# Altium project main_io.PrjPcb (part 5 of 6)

## Sheet battery_interface.SchDoc: LV Battery Interface
size A4; Organization: Badgerloop; Address1: 133 Engineering Research; Address2: Building; Address3: Madison, WI 53715; SheetNumber: 15
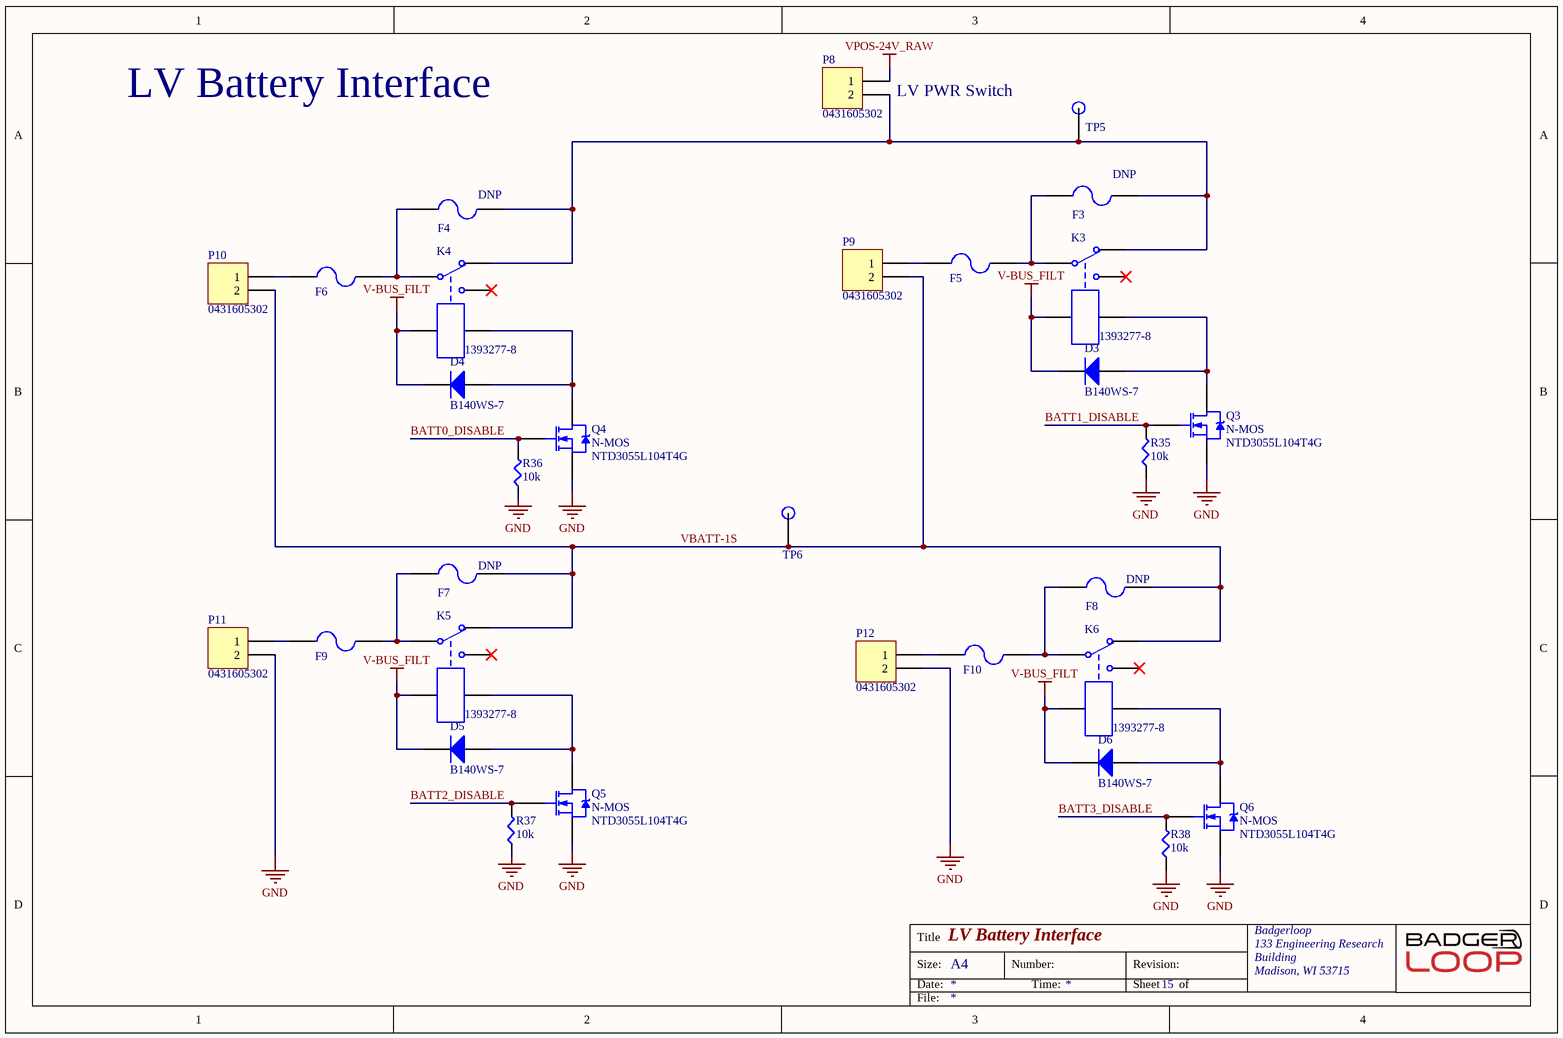
[diagram p14: battery_interface.SchDoc]

### Parts
D3  B140WS-7  [SODFL250X110-2N]
D4  B140WS-7  [SODFL250X110-2N]
D5  B140WS-7  [SODFL250X110-2N]
D6  B140WS-7  [SODFL250X110-2N]
F3  3568  [Fuse Holder 30A 500V 1 Circuit Blade Through Hole]  (value not drawn)
F4  3568  [Fuse Holder 30A 500V 1 Circuit Blade Through Hole]  (value not drawn)
F5  3568  [Fuse Holder 30A 500V 1 Circuit Blade Through Hole]  (value not drawn)
F6  3568  [Fuse Holder 30A 500V 1 Circuit Blade Through Hole]  (value not drawn)
F7  3568  [Fuse Holder 30A 500V 1 Circuit Blade Through Hole]  (value not drawn)
F8  3568  [Fuse Holder 30A 500V 1 Circuit Blade Through Hole]  (value not drawn)
F9  3568  [Fuse Holder 30A 500V 1 Circuit Blade Through Hole]  (value not drawn)
F10  3568  [Fuse Holder 30A 500V 1 Circuit Blade Through Hole]  (value not drawn)
K3  1393277-8  [RELAY AUTOMOTIVE SPDT 45A 24V - duplicate]
K4  1393277-8  [RELAY AUTOMOTIVE SPDT 45A 24V - duplicate]
K5  1393277-8  [RELAY AUTOMOTIVE SPDT 45A 24V - duplicate]
K6  1393277-8  [RELAY AUTOMOTIVE SPDT 45A 24V - duplicate]
P8  0431605302  [CONN HDR 2POS 7.50MM]
P9  0431605302  [CONN HDR 2POS 7.50MM]
P10  0431605302  [CONN HDR 2POS 7.50MM]
P11  0431605302  [CONN HDR 2POS 7.50MM]
P12  0431605302  [CONN HDR 2POS 7.50MM]
Q3  N-MOS  Manufacturer P/N: NTD3055L104T4G  [DPAK228P991X238-3N]
Q4  N-MOS  Manufacturer P/N: NTD3055L104T4G  [DPAK228P991X238-3N]
Q5  N-MOS  Manufacturer P/N: NTD3055L104T4G  [DPAK228P991X238-3N]
Q6  N-MOS  Manufacturer P/N: NTD3055L104T4G  [DPAK228P991X238-3N]
R35  10k  [SMD-0805-RES]
R36  10k  [SMD-0805-RES]
R37  10k  [SMD-0805-RES]
R38  10k  [SMD-0805-RES]
TP5  TP  [Test Point]  (value not drawn)
TP6  TP  [Test Point]  (value not drawn)

### Nets
GND: P11.2 P12.2 Q3.3(S) Q4.3(S) Q5.3(S) Q6.3(S) R35.1 R36.1 R37.1 R38.1
V-BUS_FILT: D3.2(K) D4.2(K) D5.2(K) D6.2(K) K3.1 K4.1 K5.1 K6.1  [project net MSTR_SW +]
VPOS-24V_RAW: P8.1
BATT0_DISABLE: Q4.1(G) R36.2
BATT1_DISABLE: Q3.1(G) R35.2
BATT2_DISABLE: Q5.1(G) R37.2
BATT3_DISABLE: Q6.1(G) R38.2
VBATT-1S: F7.2 F8.2 K5.3 K6.3 P9.2 P10.2 TP6.1
NetD3_1: D3.1(A) K3.2 Q3.4(D)
NetD4_1: D4.1(A) K4.2 Q4.4(D)
NetD5_1: D5.1(A) K5.2 Q5.4(D)
NetD6_1: D6.1(A) K6.2 Q6.4(D)
NetF3_1: F3.1 F5.2 K3.4
NetF3_2: F3.2 F4.2 K3.3 K4.3 P8.2 TP5.1
NetF4_1: F4.1 F6.2 K4.4
NetF5_1: F5.1 P9.1
NetF6_1: F6.1 P10.1
NetF7_1: F7.1 F9.2 K5.4
NetF8_1: F8.1 F10.2 K6.4
NetF9_1: F9.1 P11.1
NetF10_1: F10.1 P12.1

Not connected (* = marked no-connect by the designer): K3 5*; K4 5*; K5 5*; K6 5*

### Notes on the sheet
- LV Battery Interface
- (near P8) LV PWR Switch
- Title
- Size:
- Date:
- A4
- Number:
- Time:
- Revision:
- Sheet
- of
- File:

### Library data of the parts
D3-D6 = B140WS-7: as D28-D31 on sheet shutdown_circuit; Supplier 1: Digi-Key; Stock 1: 38792; Pricing 1: 1=0.41, 10=0.293, 100=0.1476, 500=0.13076, 1000=0.10176 (USD); Mount: Surface Mount; Number of Pins: 2; Weight: 0.000173oz; Contact Plating: Tin,Matte; Min Operating Temperature: -40°C; Max Operating Temperature: 125°C; Forward Current: 1A; Max Repetitive Reverse Voltage (Vrrm): 40V; Package Quantity: 3000; Packaging: Tape and Reel; Average Rectified Current: 1A; Max Forward Surge Current (Ifsm): 3A; Max Reverse Voltage (DC): 40V; Series: -; Length: 1.8mm; Width: 1.4mm; Height: 1.1mm; RoHS Compliant: Yes; ComponentLink1URL: http://www.mouser.com/ds/2/115/ds31543-56649.pdf?src-supplier=Mouser; ComponentLink1Description: http://www.mouser.com/ds/2/115/ds31543-56649.pdf?src-supplier=Mouser; ComponentLink2URL: http://www.diodes.com//datasheets/ds31543.pdf?src-supplier=Avnet+Europe; ComponentLink2Description: http://www.diodes.com//datasheets/ds31543.pdf?src-supplier=Avnet+Europe; ComponentLink3URL: http://www.diodes.com/datasheets/ds31543.pdf?src-supplier=Digi-Key; ComponentLink3Description: http://www.diodes.com/datasheets/ds31543.pdf?src-supplier=Digi-Key; Supplier Part Number 1: B140WS-7DICT-ND
F3-F10 = 3568: FUSE HOLDER MINI AUTO PC; Manufacturer: Keystone Electronics; Material: Brass,Tin,Nylon; Color: Black; Body Material: Nylon; Current Rating: 20A; Voltage Rating (AC): 500V; Number of Poles: 1; Illumination Type: Illuminated; Fuse Type: Automotive; Approvals: UL; Supplier 1: Digi-Key; Manufacturer Part Number: 3568; Stock 1: 0; Mount: PCB,Vertical; Contact Material: Brass,Tin; Contact Plating: Tin; Min Operating Temperature: -50°C; Max Operating Temperature: 145°C; Package Quantity: 1; Termination: PC Pin; Orientation: Vertical; Number of Circuits: 1; Voltage: 500V; Fuse Current: 20A; Length: 16mm; Depth: 6.73mm; Lead Free: Lead Free; REACH SVHC: No SVHC; Flammability Rating: UL94 V-0; ComponentLink1URL: http://www.keyelco.com/userAssets/file/M60-2p40.pdf?src-supplier=Future+Electronics; ComponentLink1Description: http://www.keyelco.com/userAssets/file/M60-2p40.pdf?src-supplier=Future+Electronics; ComponentLink2URL: https://www.alliedelec.com/m/d/15b4f09b8ba48c4b08efedd730709c21.pdf?src-supplier=Allied+Electronics; ComponentLink2Description: https://www.alliedelec.com/m/d/15b4f09b8ba48c4b08efedd730709c21.pdf?src-supplier=Allied+Electronics; Supplier Part Number 1: 3568K-ND
  F3 F4 F7 F8: DNP: DNP
K3-K6 = 1393277-8: RELAY AUTOMOTIVE SPDT 45A 24V; Manufacturer: TE Connectivity; Coil Current: 66.29mA; Coil Resistance: 362R; Coil Power: 1.6W; Operate Time: 5ms; Number of Contacts: 2; Release Time: 3ms; Coil Type: Non-Latching; Supplier 1: Digi-Key; Manufacturer Part Number: 1393277-8; Stock 1: 2937; Pricing 1: 1=5.39, 10=5.053, 25=4.4912, 50=4.2666, 100=4.042, 250=3.73328 (USD); Mount: Through Hole; Number of Pins: 7; Weight: 22g; Contact Material: Silver; Min Operating Temperature: -40°C; Max Operating Temperature: 105°C; Throw Configuration: SPDT; Coil Voltage (DC): 24V; Termination: PCB; Contact Current Rating: 45A; Current Rating: 45A; Packaging: Bulk; Package Quantity: 525; Relay Type: Relay; Length: 26.1mm; Height: 21.2mm; Depth: 21.1mm; Width: 21.1mm; Radiation Hardening: No; Lead Free: Lead Free; ELV: Compliant; ComponentLink1URL: https://www.verical.com/server-webapp/html/getDatasheet?partID=318318&src-supplier=Verical; ComponentLink1Description: https://www.verical.com/server-webapp/html/getDatasheet?partID=318318&src-supplier=Verical; ComponentLink2URL: https://www.te.com/commerce/DocumentDelivery/DDEController?Action=srchrtrv&DocNm=V23133-X0000-A001&DocType=DS&DocLang=English&src-supplier=Digi-Key; ComponentLink2Description: https://www.te.com/commerce/DocumentDelivery/DDEController?Action=srchrtrv&DocNm=V23133-X0000-A001&DocType=DS&DocLang=English&src-supplier=Digi-Key; Supplier Part Number 1: PB1320-ND
P8-P12 = 0431605302: Conn Power HDR 2 POS 7.49mm Solder RA Thru-Hole 4 Terminal 1 Port Sabre™ Tray; Manufacturer: Molex; Current Rating: 18A; Number of Positions: 2; Voltage Rating: 600V; Number of Ports: 1; Contact Resistance: 30mR; Supplier 1: Digi-Key; Manufacturer Part Number: 0431605302; Stock 1: 0; Mount: Through Hole; Housing Material: Nylon; Contact Material: Brass; Contact Plating: Tin,Copper; Color: Black; Insulation Material: Nylon; Number of Terminals: 4; Housing Color: Black; Min Operating Temperature: -40°C; Max Operating Temperature: 75°C; Number of Rows: 1; Packaging: Tray; Package Quantity: 525; Termination: Solder; Number of Contacts: 2; Orientation: Right Angle; Fastening Type: Ramp; Length: 21.08mm; Pitch: 7.49mm; Depth: 19.79mm; ComponentLink1URL: https://www.verical.com/server-webapp/html/getDatasheet?partID=198412&src-supplier=Verical; ComponentLink1Description: https://www.verical.com/server-webapp/html/getDatasheet?partID=198412&src-supplier=Verical; ComponentLink2URL: http://components.arrow.com/part/dataview/2942820S6220968N3303?src-supplier=Arrow; ComponentLink2Description: http://components.arrow.com/part/dataview/2942820S6220968N3303?src-supplier=Arrow; ComponentLink3URL: http://www.molex.com/pdm_docs/ps/PSX-43335-9999.pdf?src-supplier=Digi-Key; ComponentLink3Description: http://www.molex.com/pdm_docs/ps/PSX-43335-9999.pdf?src-supplier=Digi-Key; Supplier Part Number 1: WM13983-ND
Q3-Q6 = N-MOS: N-Channel Power MOSFET, 12 A, 60 V; Manufacturer: ON SEMI; Digikey Link: https://www.digikey.com/product-detail/en/on-semiconductor/NTD3055L104T4G/NTD3055L104T4GOSDKR-ND/1749196; Digikey P/N: NTD3055L104T4GOSDKR-ND
R35-R38 = ERJ-P06J103V: as R1-R5 on sheet adc; Part Number: ERJ-P06J103V; Datasheets: https://industrial.panasonic.com/cdbs/www-data/pdf/RDA0000/AOA0000C243.pdf; Image: //media.digikey.com/Renders/Panasonic%20Renders/ERJ-0805%20Pkg.jpg; Digi-Key Part Number: P10KADCT-ND; Quantity Available: 413576; Packaging: Cut Tape (CT); Series: ERJ; Part Status: Active; Value: 10k; Tolerance: ±5%; Composition: Thick Film; Features: Automotive AEC-Q200, Pulse Withstanding; Operating Temperature: -55°C ~ 155°C; Package / Case: 0805 (2012 Metric); Supplier Device Package: 0805; Size / Dimension: 0.079" L x 0.049" W (2.00mm x 1.25mm); Height - Seated (Max): 0.028" (0.70mm); Number of Terminations: 2; Failure Rate: -
TP5 TP6 = TP: SMD TEST POINT

## Sheet misc_sensors.SchDoc: Sensors
size A4; Organization: Badgerloop; Address1: 133 Engineering Research; Address2: Building; Address3: Madison, WI 53715; SheetNumber: 16
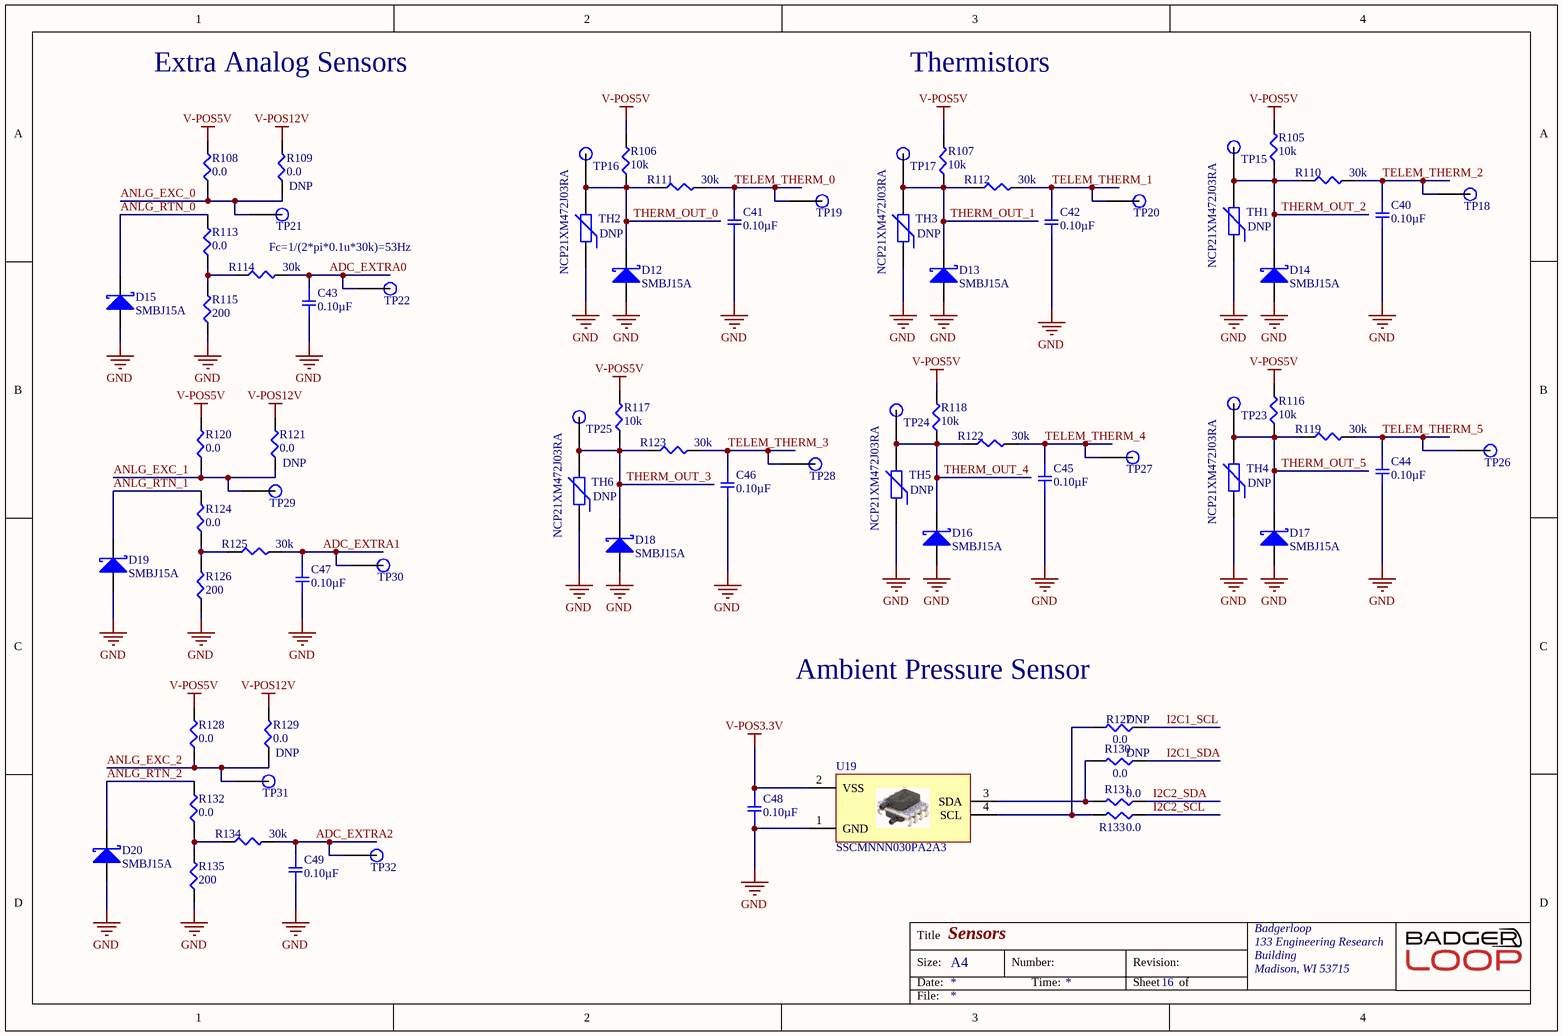
[diagram p15: misc_sensors.SchDoc]

### Parts
C40  0.10µF  [SMD-0805C]
C41  0.10µF  [SMD-0805C]
C42  0.10µF  [SMD-0805C]
C43  0.10µF  [SMD-0805C]
C44  0.10µF  [SMD-0805C]
C45  0.10µF  [SMD-0805C]
C46  0.10µF  [SMD-0805C]
C47  0.10µF  [SMD-0805C]
C48  0.10µF  [SMD-0805C]
C49  0.10µF  [SMD-0805C]
D12  SMBJ15A  [DIOM4436X26N]
D13  SMBJ15A  [DIOM4436X26N]
D14  SMBJ15A  [DIOM4436X26N]
D15  SMBJ15A  [DIOM4436X26N]
D16  SMBJ15A  [DIOM4436X26N]
D17  SMBJ15A  [DIOM4436X26N]
D18  SMBJ15A  [DIOM4436X26N]
D19  SMBJ15A  [DIOM4436X26N]
D20  SMBJ15A  [DIOM4436X26N]
R105  10k  [SMD-0805-RES]
R106  10k  [SMD-0805-RES]
R107  10k  [SMD-0805-RES]
R108  0.0  [SMD-0805-RES]
R109  0.0  [SMD-0805-RES]
R110  30k  [SMD-0805-RES]
R111  30k  [SMD-0805-RES]
R112  30k  [SMD-0805-RES]
R113  0.0  [SMD-0805-RES]
R114  30k  [SMD-0805-RES]
R115  200  [SMD-0805-RES]
R116  10k  [SMD-0805-RES]
R117  10k  [SMD-0805-RES]
R118  10k  [SMD-0805-RES]
R119  30k  [SMD-0805-RES]
R120  0.0  [SMD-0805-RES]
R121  0.0  [SMD-0805-RES]
R122  30k  [SMD-0805-RES]
R123  30k  [SMD-0805-RES]
R124  0.0  [SMD-0805-RES]
R125  30k  [SMD-0805-RES]
R126  200  [SMD-0805-RES]
R127  0.0  [SMD-0805-RES]
R128  0.0  [SMD-0805-RES]
R129  0.0  [SMD-0805-RES]
R130  0.0  [SMD-0805-RES]
R131  0.0  [SMD-0805-RES]
R132  0.0  [SMD-0805-RES]
R133  0.0  [SMD-0805-RES]
R134  30k  [SMD-0805-RES]
R135  200  [SMD-0805-RES]
TH1  NCP21XM472J03RA  [SMD-0805-RES]
TH2  NCP21XM472J03RA  [SMD-0805-RES]
TH3  NCP21XM472J03RA  [SMD-0805-RES]
TH4  NCP21XM472J03RA  [SMD-0805-RES]
TH5  NCP21XM472J03RA  [SMD-0805-RES]
TH6  NCP21XM472J03RA  [SMD-0805-RES]
TP15  TP  [Test Point]  (value not drawn)
TP16  TP  [Test Point]  (value not drawn)
TP17  TP  [Test Point]  (value not drawn)
TP18  TP  [Test Point]  (value not drawn)
TP19  TP  [Test Point]  (value not drawn)
TP20  TP  [Test Point]  (value not drawn)
TP21  TP  [Test Point]  (value not drawn)
TP22  TP  [Test Point]  (value not drawn)
TP23  TP  [Test Point]  (value not drawn)
TP24  TP  [Test Point]  (value not drawn)
TP25  TP  [Test Point]  (value not drawn)
TP26  TP  [Test Point]  (value not drawn)
TP27  TP  [Test Point]  (value not drawn)
TP28  TP  [Test Point]  (value not drawn)
TP29  TP  [Test Point]  (value not drawn)
TP30  TP  [Test Point]  (value not drawn)
TP31  TP  [Test Point]  (value not drawn)
TP32  TP  [Test Point]  (value not drawn)
U19  SSCMNNN030PA2A3  [8-SMT]

### Nets
GND: C40.2 C41.2 C42.2 C43.2 C44.2 C45.2 C46.2 C47.2 C48.2 C49.2 D12.2(K) D13.2(K) D14.2(K) D15.2(K) D16.2(K) D17.2(K) D18.2(K) D19.2(K) D20.2(K) R115.1 R126.1 R135.1 TH1.1 TH2.1 TH3.1 TH4.1 TH5.1 TH6.1 U19.1(GND)
V-POS3.3V: C48.1 U19.2(VSS)
V-POS5V: R105.2 R106.2 R107.2 R108.2 R116.2 R117.2 R118.2 R120.2 R128.2
V-POS12V: R109.2 R121.2 R129.2
ADC_EXTRA0: C43.1 R114.2 TP22.1
ADC_EXTRA1: C47.1 R125.2 TP30.1
ADC_EXTRA2: C49.1 R134.2 TP32.1
ANLG_EXC_0: R108.1 R109.1 TP21.1
ANLG_EXC_1: R120.1 R121.1 TP29.1
ANLG_EXC_2: R128.1 R129.1 TP31.1
ANLG_RTN_0: D15.1(A) R113.2
ANLG_RTN_1: D19.1(A) R124.2
ANLG_RTN_2: D20.1(A) R132.2
I2C1_SCL: R127.1
I2C1_SDA: R130.1
I2C2_SCL: R133.1
I2C2_SDA: R131.1
TELEM_THERM_0: C41.1 R111.2 TP19.1
TELEM_THERM_1: C42.1 R112.2 TP20.1
TELEM_THERM_2: C40.1 R110.2 TP18.1
TELEM_THERM_3: C46.1 R123.2 TP28.1
TELEM_THERM_4: C45.1 R122.2 TP27.1
TELEM_THERM_5: C44.1 R119.2 TP26.1
THERM_OUT_0: D12.1(A) R106.1 R111.1 TH2.2 TP16.1
THERM_OUT_1: D13.1(A) R107.1 R112.1 TH3.2 TP17.1
THERM_OUT_2: D14.1(A) R105.1 R110.1 TH1.2 TP15.1
THERM_OUT_3: D18.1(A) R117.1 R123.1 TH6.2 TP25.1
THERM_OUT_4: D16.1(A) R118.1 R122.1 TH5.2 TP24.1
THERM_OUT_5: D17.1(A) R116.1 R119.1 TH4.2 TP23.1
NetR113_1: R113.1 R114.1 R115.2
NetR124_1: R124.1 R125.1 R126.2
NetR127_2: R127.2 R133.2 U19.4(SCL)
NetR130_2: R130.2 R131.2 U19.3(SDA)
NetR132_1: R132.1 R134.1 R135.2

### Notes on the sheet
- Extra Analog Sensors
- Thermistors
- Fc=1/(2*pi*0.1u*30k)=53Hz
- (near R127) Ambient Pressure Sensor
- Title
- Size:
- Date:
- A4
- Number:
- Time:
- Revision:
- Sheet
- of
- File:

### Library data of the parts
C40-C42 C44-C46 = GRM219R71C104KA01D: CAP CER 0.1UF 16V X7R 0805; Manufacturer: Murata Electronics North America; Factory Stock: 0; Unit Price (USD): 0.13; Minimum Quantity: 1; Tolerance: ±10%; Datasheets: http://www.murata.com/~/media/webrenewal/support/library/catalog/products/capacitor/mlcc/c02e.pdf; Image: //media.digikey.com/Renders/Murata%20Renders/0805%20(2012%20Metric)%20.85mm.jpg; Digi-Key Part Number: 490-1683-1-ND; Part Number: GRM219R71C104KA01D; Quantity Available: 265464; @ qty: 0; Packaging: Cut Tape (CT); Series: GRM; Part Status: Active; Value: 0.10µF; Voltage: 16V; Temperature Coefficient: X7R; Operating Temperature: -55°C ~ 125°C; Features: -; Ratings: -; Applications: General Purpose; Mounting Type: Surface Mount, MLCC; Package / Case: 0805 (2012 Metric); Size / Dimension: 0.079" L x 0.049" W (2.00mm x 1.25mm); Height - Seated (Max): -; Thickness (Max): 0.037" (0.95mm); Lead Spacing: -; Lead Style: -
C43 C47-C49 = GRM219R71E104KA01D: CAP CER 0.1UF 25V X7R 0805; Manufacturer: Murata Electronics North America; Factory Stock: 0; Unit Price (USD): 0.12; Minimum Quantity: 1; Tolerance: ±10%; Datasheets: http://www.murata.com/~/media/webrenewal/support/library/catalog/products/capacitor/mlcc/c02e.pdf; Image: //media.digikey.com/Renders/Murata%20Renders/0805%20(2012%20Metric)%20.85mm.jpg; Digi-Key Part Number: 490-12754-1-ND; Part Number: GRM219R71E104KA01D; Quantity Available: 8594; @ qty: 0; Packaging: Cut Tape (CT); Series: GRM; Part Status: Active; Value: 0.10µF; Voltage: 25V; Temperature Coefficient: X7R; Operating Temperature: -55°C ~ 125°C; Features: -; Ratings: -; Applications: General Purpose; Mounting Type: Surface Mount, MLCC; Package / Case: 0805 (2012 Metric); Size / Dimension: 0.079" L x 0.049" W (2.00mm x 1.25mm); Height - Seated (Max): -; Thickness (Max): 0.037" (0.95mm); Lead Spacing: -; Lead Style: -
D12-D20 = SMBJ15A: TVS DIODE 15V 24.4V DO214AA; Manufacturer: Littelfuse; Direction: Unidirectional; Min Breakdown Voltage: 16.7V; Peak Pulse Power: 600W; Peak Pulse Current: 24.6A; Test Current: 1mA; Number of Elements: 1; Power Line Protection: No; Max Breakdown Voltage: 18.5V; Max Reverse Leakage Current: 1uA; Max Power Dissipation: 5W; Element Configuration: Single; ESD Protection: Yes; Current: 68A; Voltage: 5V; Supplier 1: Digi-Key; Stock 1: 73945; Pricing 1: 1=0.45000, 10=0.33900, 25=0.30520, 100=0.21090, 250=0.17760, 500=0.14430, 1000=0.11100 (USD); RoHS: Yes; Mount: Surface Mount; Case/Package: SMB; Number of Pins: 2; Min Operating Temperature: -65°C; Max Operating Temperature: 150°C; Packaging: Tape and Reel; Reverse Standoff Voltage: 15V; Clamping Voltage: 24.4V; Power Dissipation: 600W; Voltage Rating (DC): 15V; Reverse Breakdown Voltage: 16.7V; Package Quantity: 3000; Operating Supply Voltage: 15V; Max Surge Current: 24.6A; Number of Unidirectional Channels: 1; Breakdown Voltage: 16.7V; Number of Channels: 1; Polarity: Unidirectional; Termination: SMD/SMT; Leakage Current: 1uA; Composition: Zener; Length: 4.57mm; Height: 2.237mm; Width: 3.94mm; Radiation Hardening: No; Lead Free: Lead Free; REACH SVHC: Unknown; ComponentLink1URL: https://datasheet.ciiva.com/34301/1078555-34301957.pdf?src-supplier=Jameco; ComponentLink1Description: https://datasheet.ciiva.com/34301/1078555-34301957.pdf?src-supplier=Jameco; ComponentLink2URL: https://datasheet.ciiva.com/25624/0900766b810f4eeb-25624826.pdf?src-supplier=RSComponents; ComponentLink2Description: https://datasheet.ciiva.com/25624/0900766b810f4eeb-25624826.pdf?src-supplier=RSComponents; ComponentLink3URL: https://datasheet.ciiva.com/46385/13057-46385079.pdf?src-supplier=Element14; ComponentLink3Description: https://datasheet.ciiva.com/46385/13057-46385079.pdf?src-supplier=Element14; ComponentLink4URL: https://datasheet.ciiva.com/331/littelfuse-tvs-diode-smbj-datasheet-pdf-331176.pdf?src-supplier=Digi-Key; ComponentLink4Description: https://datasheet.ciiva.com/331/littelfuse-tvs-diode-smbj-datasheet-pdf-331176.pdf?src-supplier=Digi-Key; ComponentLink5URL: https://datasheet.ciiva.com/331/littelfuse-tvs-diode-smbj-datasheet-pdf-331177.pdf?src-supplier=Digi-Key; ComponentLink5Description: https://datasheet.ciiva.com/331/littelfuse-tvs-diode-smbj-datasheet-pdf-331177.pdf?src-supplier=Digi-Key; ComponentLink6URL: https://datasheet.ciiva.com/331/littelfuse-tvs-diode-smbj-datasheet-pdf-331178.pdf?src-supplier=Digi-Key; ComponentLink6Description: https://datasheet.ciiva.com/331/littelfuse-tvs-diode-smbj-datasheet-pdf-331178.pdf?src-supplier=Digi-Key; Supplier 2: Digi-Key; Stock 2: 69911; Pricing 2: 1=0.35000, 10=0.28700, 25=0.26240, 100=0.19540, 250=0.17704, 500=0.14652, 1000=0.10989 (USD); ComponentLink7URL: https://datasheet.ciiva.com/25624/0900766b810f4eeb-25624712.pdf?src-supplier=RSComponents; ComponentLink7Description: https://datasheet.ciiva.com/25624/0900766b810f4eeb-25624712.pdf?src-supplier=RSComponents; ComponentLink8URL: https://datasheet.ciiva.com/34302/1546929-34302459.pdf?src-supplier=Jameco; ComponentLink8Description: https://datasheet.ciiva.com/34302/1546929-34302459.pdf?src-supplier=Jameco; ComponentLink9URL: https://datasheet.ciiva.com/46381/1677318-46381958.pdf?src-supplier=Element14; ComponentLink9Description: https://datasheet.ciiva.com/46381/1677318-46381958.pdf?src-supplier=Element14; ComponentLink10URL: https://datasheet.ciiva.com/331/littelfuse-tvs-diode-smbj-datasheet-pdf-331131.pdf?src-supplier=Digi-Key; ComponentLink10Description: https://datasheet.ciiva.com/331/littelfuse-tvs-diode-smbj-datasheet-pdf-331131.pdf?src-supplier=Digi-Key; ComponentLink11URL: https://datasheet.ciiva.com/331/littelfuse-tvs-diode-smbj-datasheet-pdf-331132.pdf?src-supplier=Digi-Key; ComponentLink11Description: https://datasheet.ciiva.com/331/littelfuse-tvs-diode-smbj-datasheet-pdf-331132.pdf?src-supplier=Digi-Key; ComponentLink12URL: https://datasheet.ciiva.com/331/littelfuse-tvs-diode-smbj-datasheet-pdf-331133.pdf?src-supplier=Digi-Key; ComponentLink12Description: https://datasheet.ciiva.com/331/littelfuse-tvs-diode-smbj-datasheet-pdf-331133.pdf?src-supplier=Digi-Key; Supplier Part Number 2: SMBJ5.0ALFCT-ND; Supplier Part Number 1: SMBJ15ALFCT-ND
R105-R107 R116-R118 = ERJ-P06F1002V: RES SMD 10K OHM 1% 1/2W 0805; Manufacturer: Panasonic Electronic Components; Factory Stock: 0; Unit Price (USD): 0.02534; @ qty: 1500; Minimum Quantity: 1; Power (Watts): 0.5W, 1/2W; Temperature Coefficient: ±100ppm/°C; Part Number: ERJ-P06F1002V; Datasheets: https://industrial.panasonic.com/cdbs/www-data/pdf/RDA0000/AOA0000C243.pdf; Image: //media.digikey.com/Renders/Panasonic%20Renders/ERJ-0805%20Pkg.jpg; Digi-Key Part Number: P16059CT-ND; Quantity Available: 42054; Packaging: Cut Tape (CT); Series: ERJ; Part Status: Active; Value: 10k; Tolerance: ±1%; Composition: Thick Film; Features: Automotive AEC-Q200, Pulse Withstanding; Operating Temperature: -55°C ~ 155°C; Package / Case: 0805 (2012 Metric); Supplier Device Package: 0805; Size / Dimension: 0.079" L x 0.049" W (2.00mm x 1.25mm); Height - Seated (Max): 0.028" (0.70mm); Number of Terminations: 2; Failure Rate: -
R108 R109 R113 R120 R121 R124 R127-R133 = ERJ-6GEY0R00V: as R6-R9 on sheet adc; Part Number: ERJ-6GEY0R00V; Datasheets: http://industrial.panasonic.com/www-cgi/jvcr13pz.cgi?E+PZ+3+AOA0001+ERJ6GEY0R00V+7+WW; Image: //media.digikey.com/Renders/Panasonic%20Renders/ERJ-0805%20Pkg.jpg; Digi-Key Part Number: P0.0ACT-ND; Quantity Available: 1597627; Packaging: Cut Tape (CT); Series: ERJ; Part Status: Active; Value: 0.0; Tolerance: Jumper; Composition: Thick Film; Features: Automotive AEC-Q200; Temperature Coefficient: -; Operating Temperature: -55°C ~ 155°C; Package / Case: 0805 (2012 Metric); Supplier Device Package: 0805; Size / Dimension: 0.079" L x 0.049" W (2.00mm x 1.25mm); Height - Seated (Max): 0.028" (0.70mm); Number of Terminations: 2; Failure Rate: -
  R109 R121 R127 R129 R130: DNP: DNP
R110-R112 R114 R119 R122 R123 R125 R134 = ERJ-6ENF3002V: RES SMD 30K OHM 1% 1/8W 0805; Manufacturer: Panasonic Electronic Components; Factory Stock: 0; Unit Price (USD): 0.00729; @ qty: 1500; Minimum Quantity: 1; Power (Watts): 0.125W, 1/8W; Temperature Coefficient: ±100ppm/°C; Part Number: ERJ-6ENF3002V; Datasheets: http://industrial.panasonic.com/www-cgi/jvcr13pz.cgi?E+PZ+3+AOA0002+ERJ6ENF3002V+7+WW; Image: //media.digikey.com/Renders/Panasonic%20Renders/ERJ-0805%20Pkg.jpg; Digi-Key Part Number: P30.0KCCT-ND; Quantity Available: 88046; Packaging: Cut Tape (CT); Series: ERJ; Part Status: Active; Value: 30k; Tolerance: ±1%; Composition: Thick Film; Features: Automotive AEC-Q200; Operating Temperature: -55°C ~ 155°C; Package / Case: 0805 (2012 Metric); Supplier Device Package: 0805; Size / Dimension: 0.079" L x 0.049" W (2.00mm x 1.25mm); Height - Seated (Max): 0.028" (0.70mm); Number of Terminations: 2; Failure Rate: -
R115 R126 R135 = ERJ-P06F2000V: RES SMD 200 OHM 1% 1/2W 0805; Manufacturer: Panasonic Electronic Components; Factory Stock: 0; Unit Price (USD): 0.02534; @ qty: 1500; Minimum Quantity: 1; Power (Watts): 0.5W, 1/2W; Temperature Coefficient: ±100ppm/°C; Part Number: ERJ-P06F2000V; Datasheets: https://industrial.panasonic.com/cdbs/www-data/pdf/RDA0000/AOA0000C243.pdf; Image: //media.digikey.com/Renders/Panasonic%20Renders/ERJ-0805%20Pkg.jpg; Digi-Key Part Number: P16064CT-ND; Quantity Available: 14258; Packaging: Cut Tape (CT); Series: ERJ; Part Status: Active; Value: 200; Tolerance: ±1%; Composition: Thick Film; Features: Automotive AEC-Q200, Pulse Withstanding; Operating Temperature: -55°C ~ 155°C; Package / Case: 0805 (2012 Metric); Supplier Device Package: 0805; Size / Dimension: 0.079" L x 0.049" W (2.00mm x 1.25mm); Height - Seated (Max): 0.028" (0.70mm); Number of Terminations: 2; Failure Rate: -
TH1-TH6 = NCP21XM472J03RA: NTC THERMISTOR 4.7K OHM 5% 0805; Manufacturer: Murata; Resistance: 4.7kR; Power Rating: 200mW; Current Rating: 650uA; Accuracy: 3%; Supplier 1: Digi-Key; Manufacturer Part Number: NCP21XM472J03RA; Stock 1: 51855; Pricing 1: 1=0.20000, 5=0.19400, 10=0.17300, 25=0.15920, 50=0.12760, 100=0.10930, 500=0.09564, 1000=0.08197 (USD); RoHS: Yes; Mount: Surface Mount; Case/Package: 0805; Number of Pins: 2; Case Code (Metric): 2012; Case Code (Imperial): 0805; Min Operating Temperature: -40°C; Max Operating Temperature: 125°C; Tolerance: 5%; Packaging: Tape and Reel; Package Quantity: 4000; Max Power Dissipation: 200mW; Termination: SMD/SMT; Length: 2mm; Height: 0.85mm; Depth: 1.25mm; Width: 1.25mm; Radiation Hardening: No; REACH SVHC: No SVHC; Lead Free: Lead Free; ComponentLink1URL: https://datasheet.ciiva.com/30488/0900766b81259d06-30488337.pdf?src-supplier=RSComponents; ComponentLink1Description: https://datasheet.ciiva.com/30488/0900766b81259d06-30488337.pdf?src-supplier=RSComponents; ComponentLink2URL: https://datasheet.ciiva.com/2848/r44e-2848550.pdf?src-supplier=Digi-Key; ComponentLink2Description: https://datasheet.ciiva.com/2848/r44e-2848550.pdf?src-supplier=Digi-Key; ComponentLink3URL: https://datasheet.ciiva.com/24155/r44e-24155222.pdf?src-supplier=Future+Electronics; ComponentLink3Description: https://datasheet.ciiva.com/24155/r44e-24155222.pdf?src-supplier=Future+Electronics; ComponentLink4URL: https://datasheet.ciiva.com/2848/r44e-2848551.pdf?src-supplier=Digi-Key; ComponentLink4Description: https://datasheet.ciiva.com/2848/r44e-2848551.pdf?src-supplier=Digi-Key; ComponentLink5URL: https://datasheet.ciiva.com/2848/r44e-2848552.pdf?src-supplier=Digi-Key; ComponentLink5Description: https://datasheet.ciiva.com/2848/r44e-2848552.pdf?src-supplier=Digi-Key; ComponentLink6URL: https://datasheet.ciiva.com/16634/l0770c-16634105.pdf?src-supplier=Avnet+Europe; ComponentLink6Description: https://datasheet.ciiva.com/16634/l0770c-16634105.pdf?src-supplier=Avnet+Europe; ComponentLink7URL: https://datasheet.ciiva.com/3280/l0770c-3280522.pdf?src-supplier=Avnet; ComponentLink7Description: https://datasheet.ciiva.com/3280/l0770c-3280522.pdf?src-supplier=Avnet; Supplier Part Number 1: 490-2453-1-ND; DNP: DNP
TP15-TP32 = TP: SMD TEST POINT
U19 = SSCMNNN030PA2A3: Honeywell Digital Pressure Sensor; ComponentLink1Description: Part; ComponentLink1URL: https://www.digikey.com/product-detail/en/honeywell-sensing-and-productivity-solutions/SSCMNNN030PA2A3/480-6407-ND/2416123; ComponentLink2Description: Datasheet; ComponentLink2URL: https://sensing.honeywell.com/index.php?ci_id=151134

## Sheet batt_protection.SchDoc: Battery Protection
size A4; Organization: Badgerloop; Address1: 133 Engineering Research; Address2: Building; Address3: Madison, WI 53715; SheetNumber: 17
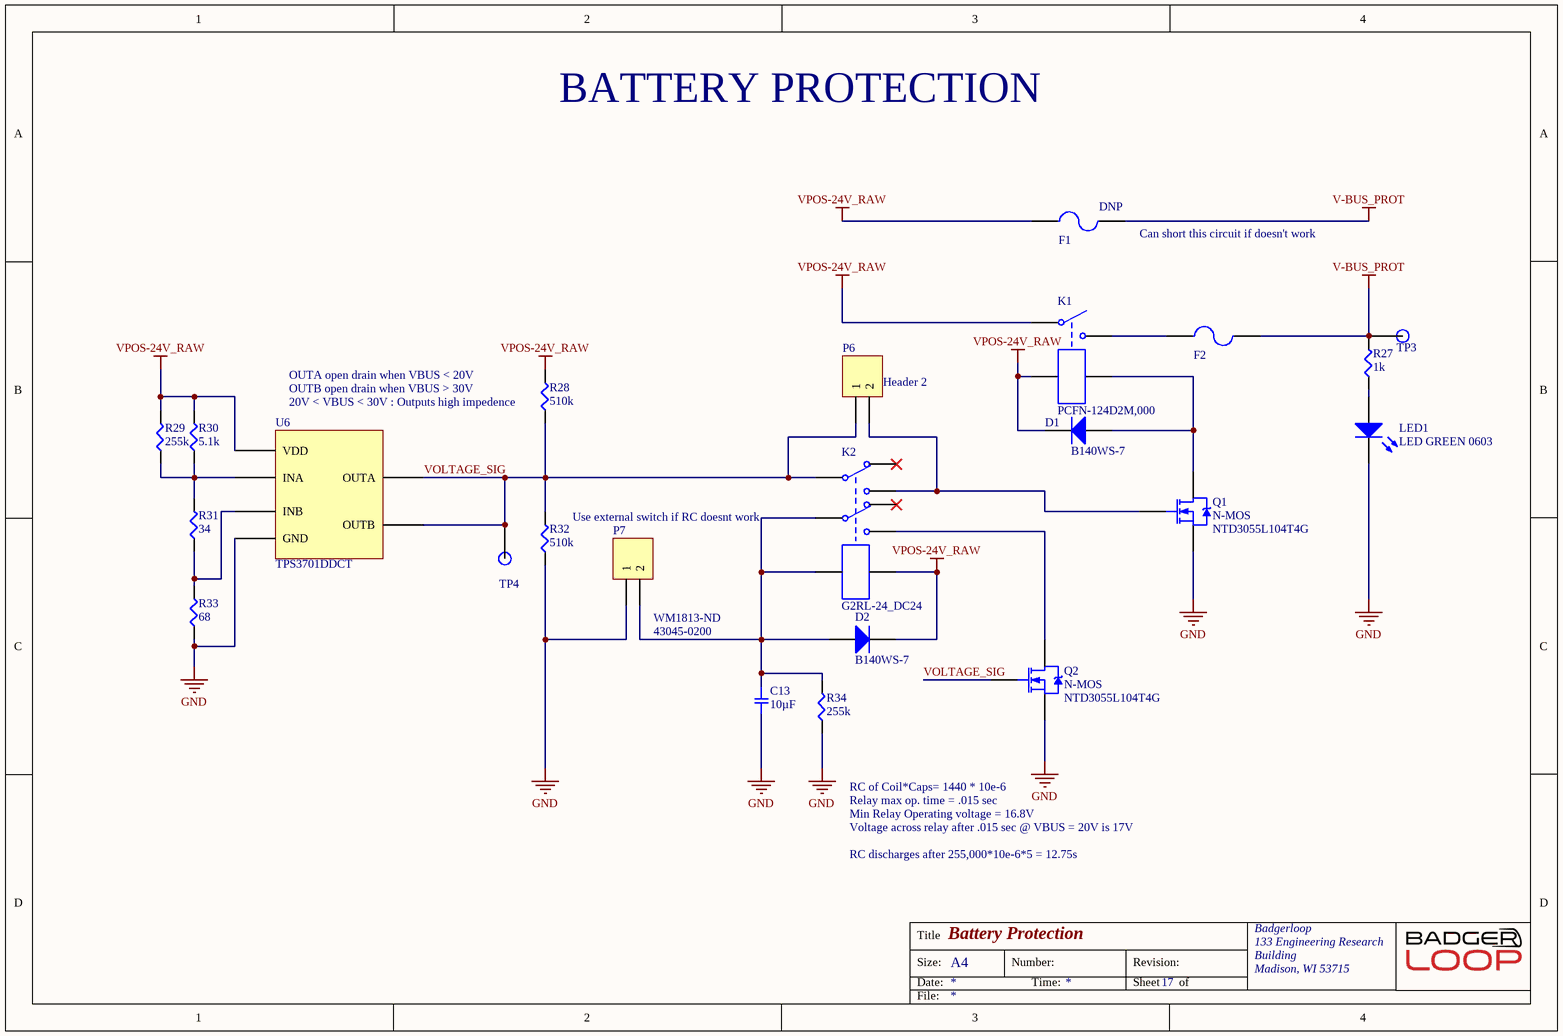
[diagram p16: batt_protection.SchDoc]

### Parts
C13  10µF  [SMD-1206C]
D1  B140WS-7  [SODFL250X110-2N]
D2  B140WS-7  [SODFL250X110-2N]
F1  3568  [Fuse Holder 30A 500V 1 Circuit Blade Through Hole]  (value not drawn)
F2  3568  [Fuse Holder 30A 500V 1 Circuit Blade Through Hole]  (value not drawn)
K1  PCFN-124D2M,000  [PCFN-124D2M,000]
K2  G2RL-24_DC24  [G2RL]
LED1  LED GREEN 0603  [LED 0603 GREEN]
P6  Header 2  [Pin Header 1x2 TH Pitch 2.54mm]
P7  43045-0200  Supplier Part Number 1: WM1813-ND  [430450200]
Q1  N-MOS  Manufacturer P/N: NTD3055L104T4G  [DPAK228P991X238-3N]
Q2  N-MOS  Manufacturer P/N: NTD3055L104T4G  [DPAK228P991X238-3N]
R27  1k  [SMD-0805-RES]
R28  510k  [SMD-0805-RES]
R29  255k  [SMD-0805-RES]
R30  5.1k  [SMD-0805-RES]
R31  34  [SMD-0805-RES]
R32  510k  [SMD-0805-RES]
R33  68  [SMD-0805-RES]
R34  255k  [SMD-0805-RES]
TP3  TP  [Test Point]  (value not drawn)
TP4  TP  [Test Point]  (value not drawn)
U6  TPS3701DDCT  [TSOP95P280X110-6N]

### Nets
GND: C13.2 LED1.2(K) P7.1 Q1.3(S) Q2.3(S) R32.1 R33.1 R34.1 U6.2(GND)
V-BUS_PROT: F1.2 F2.2 R27.2 TP3.1
VPOS-24V_RAW: D1.2(K) D2.2(K) F1.1 K1.1 K1.3 K2.8 R28.2 R29.2 R30.2 U6.5(VDD)
VOLTAGE_SIG: K2.3 P6.1 Q2.1(G) R28.1 R32.2 TP4.1 U6.1(OUTA) U6.6(OUTB)
NetC13_1: C13.1 D2.1(A) K2.1 K2.6 P7.2 R34.2
NetD1_1: D1.1(A) K1.2 Q1.4(D)
NetF2_1: F2.1 K1.4
NetK2_4: K2.4 P6.2 Q1.1(G)
NetK2_5: K2.5 Q2.4(D)
NetLED1_1: LED1.1(A) R27.1
NetR29_1: R29.1 R30.1 R31.2 U6.3(INA)
NetR31_1: R31.1 R33.2 U6.4(INB)

Not connected (* = marked no-connect by the designer): K2 2* 7*

### Notes on the sheet
- BATTERY PROTECTION
- (near F1) Can short this circuit if doesn't work
- OUTA open drain when VBUS < 20V
- OUTB open drain when VBUS > 30V
- (near R28) 20V < VBUS < 30V : Outputs high impedence
- (near R32) Use external switch if RC doesnt work
- RC of Coil*Caps= 1440 * 10e-6
- Relay max op. time = .015 sec
- Voltage across relay after .015 sec @ VBUS = 20V is 17V
- Min Relay Operating voltage = 16.8V
- RC discharges after 255,000*10e-6*5 = 12.75s
- Title
- Size:
- Date:
- A4
- Number:
- Time:
- Revision:
- Sheet
- of
- File:

### Library data of the parts
C13 = GRM31CR61H106KA12L: CAP CER 10UF 50V X5R 1206; Manufacturer: Murata Electronics North America; Factory Stock: 0; Unit Price (USD): 0.65; Minimum Quantity: 1; Tolerance: ±10%; Datasheets: http://www.murata.com/~/media/webrenewal/support/library/catalog/products/capacitor/mlcc/c02e.pdf; Image: //media.digikey.com/Renders/Murata%20Renders/GR331BD72E473KW01L.jpg; Digi-Key Part Number: 490-5961-1-ND; Part Number: GRM31CR61H106KA12L; Quantity Available: 86736; @ qty: 0; Packaging: Cut Tape (CT); Series: GRM; Part Status: Active; Value: 10µF; Voltage: 50V; Temperature Coefficient: X5R; Operating Temperature: -55°C ~ 85°C; Features: -; Ratings: -; Applications: General Purpose; Mounting Type: Surface Mount, MLCC; Package / Case: 1206 (3216 Metric); Size / Dimension: 0.126" L x 0.063" W (3.20mm x 1.60mm); Height - Seated (Max): -; Thickness (Max): 0.071" (1.80mm); Lead Spacing: -; Lead Style: -
D1 D2 = B140WS-7: as D28-D31 on sheet shutdown_circuit; Supplier 1: Digi-Key; Stock 1: 38792; Pricing 1: 1=0.41, 10=0.293, 100=0.1476, 500=0.13076, 1000=0.10176 (USD); Mount: Surface Mount; Number of Pins: 2; Weight: 0.000173oz; Contact Plating: Tin,Matte; Min Operating Temperature: -40°C; Max Operating Temperature: 125°C; Forward Current: 1A; Max Repetitive Reverse Voltage (Vrrm): 40V; Package Quantity: 3000; Packaging: Tape and Reel; Average Rectified Current: 1A; Max Forward Surge Current (Ifsm): 3A; Max Reverse Voltage (DC): 40V; Series: -; Length: 1.8mm; Width: 1.4mm; Height: 1.1mm; RoHS Compliant: Yes; ComponentLink1URL: http://www.mouser.com/ds/2/115/ds31543-56649.pdf?src-supplier=Mouser; ComponentLink1Description: http://www.mouser.com/ds/2/115/ds31543-56649.pdf?src-supplier=Mouser; ComponentLink2URL: http://www.diodes.com//datasheets/ds31543.pdf?src-supplier=Avnet+Europe; ComponentLink2Description: http://www.diodes.com//datasheets/ds31543.pdf?src-supplier=Avnet+Europe; ComponentLink3URL: http://www.diodes.com/datasheets/ds31543.pdf?src-supplier=Digi-Key; ComponentLink3Description: http://www.diodes.com/datasheets/ds31543.pdf?src-supplier=Digi-Key; Supplier Part Number 1: B140WS-7DICT-ND
F1 F2 = 3568: as F3 on sheet battery_interface; Supplier 1: Digi-Key; Manufacturer Part Number: 3568; Stock 1: 0; Mount: PCB,Vertical; Contact Material: Brass,Tin; Contact Plating: Tin; Min Operating Temperature: -50°C; Max Operating Temperature: 145°C; Package Quantity: 1; Termination: PC Pin; Orientation: Vertical; Number of Circuits: 1; Voltage: 500V; Fuse Current: 20A; Length: 16mm; Depth: 6.73mm; Lead Free: Lead Free; REACH SVHC: No SVHC; Flammability Rating: UL94 V-0; ComponentLink1URL: http://www.keyelco.com/userAssets/file/M60-2p40.pdf?src-supplier=Future+Electronics; ComponentLink1Description: http://www.keyelco.com/userAssets/file/M60-2p40.pdf?src-supplier=Future+Electronics; ComponentLink2URL: https://www.alliedelec.com/m/d/15b4f09b8ba48c4b08efedd730709c21.pdf?src-supplier=Allied+Electronics; ComponentLink2Description: https://www.alliedelec.com/m/d/15b4f09b8ba48c4b08efedd730709c21.pdf?src-supplier=Allied+Electronics; Supplier Part Number 1: 3568K-ND
  F1: DNP: DNP
K1 = PCFN-124D2M,000: RELAY, PCB, SPST-NO, 24VDC, 25A; Manufacturer: TE Connectivity; Coil Current: 37.5mA; Throw Configuration: SPST; Coil Resistance: 640R; Operate Time: 20ms; Release Time: 10ms; Coil Power: 1W; Relay Type: General Purpose; Coil Type: Non-Latching; Coil Voltage (DC): 24V; Contact Voltage Rating (AC): 277V; Approvals: UL,VDE; Supplier 1: Digi-Key; Stock 1: 401; Pricing 1: 1=3.7, 10=3.473, 25=3.0872, 50=2.9326, 100=2.7783, 250=2.4696, 500=2.31526, 1000=2.1609 (USD); Mount: Through Hole,PCB; Weight: 28g; Contact Material: Tin,Silver; Min Operating Temperature: -30°C; Max Operating Temperature: 55°C; Contact Current Rating: 25A; Termination: PCB; Package Quantity: 500; Packaging: Rail/Tube; Current Rating: 25A; Voltage Rating (DC): 24V; Length: 30.4mm; Height: 1.043inch; Depth: 16mm; Width: 0.63inch; REACH SVHC: Unknown; ELV: Compliant; ComponentLink1URL: http://www.farnell.com/cad/1652771.pdf?src-supplier=Element14; ComponentLink1Description: http://www.farnell.com/cad/1652771.pdf?src-supplier=Element14; ComponentLink2URL: http://www.farnell.com/datasheets/2043483.pdf?src-supplier=Farnell; ComponentLink2Description: http://www.farnell.com/datasheets/2043483.pdf?src-supplier=Farnell; Supplier Part Number 1: PB2178-ND; ComponentLink3Description: https://www.te.com/commerce/DocumentDelivery/DDEController?Action=srchrtrv&DocNm=PCFN_solar_relay_datasheet&DocType=DS&DocLang=English; ComponentLink3URL: https://www.te.com/commerce/DocumentDelivery/DDEController?Action=srchrtrv&DocNm=PCFN_solar_relay_datasheet&DocType=DS&DocLang=English
K2 = G2RL-24_DC24: as K8-K11 on sheet shutdown_circuit; Supplier 1: Digi-Key; Stock 1: 13387; Pricing 1: 1=4.32, 10=4.053, 25=3.6028, 50=3.4226, 100=3.2425, 250=2.88224, 500=2.7021 (USD); Mount: Through Hole; Case/Package: DIP; Number of Pins: 8; Weight: 12g; Contact Material: Silver,Cadmium; Min Operating Temperature: -40°C; Max Operating Temperature: 85°C; Max Current Rating: 8A; Packaging: Bulk; Max Voltage Rating (AC): 440V; Max Voltage Rating (DC): 300V; Package Quantity: 20; Throw Configuration: DPDT; Termination: PC Pin; Contact Current Rating: 8A; Coil Voltage (DC): 24V; Coil Power: 400mW; Power Rating: 400mW; Length: 29mm; Height: 15.7mm; Width: 12.7mm; Depth: 12.7mm; Radiation Hardening: No; Lead Free: Lead Free; ComponentLink1URL: http://www.alliedelec.com/images/products/datasheets/bm/OMRON_ELECTRONICS_LLC/70175264.pdf?src-supplier=Allied+Electronics; ComponentLink1Description: http://www.alliedelec.com/images/products/datasheets/bm/OMRON_ELECTRONICS_LLC/70175264.pdf?src-supplier=Allied+Electronics; ComponentLink2URL: http://www.mouser.com/ds/2/307/en-g2rl-472571.pdf?src-supplier=Mouser; ComponentLink2Description: http://www.mouser.com/ds/2/307/en-g2rl-472571.pdf?src-supplier=Mouser
LED1 = LED GREEN 0603: as LED10-LED16 on sheet shutdown_circuit; Digikey P/N: 160-1435-1-ND; Package / Case: 0603; Color: GREEN
P6 = Header 2: Header, 2-Pin; LatestRevisionDate: 17-Jul-2002; LatestRevisionNote: Re-released for DXP Platform.; Publisher: Altium Limited
P7 = 43045-0200: CONN HEADER R/A 2POS; Manufacturer: Molex; Contact Resistance: 10mR; Number of Contacts: 2; Voltage Rating: 600V; Current Rating: 5A; Gender: Male; Max Voltage Rating (DC): 250.25kV; Voltage Rating (DC): 250V; Insulation Resistance: 1GR; Pitch: 3mm; Glow Wire Compliant: Compliant; Approvals: UL,CSA,TUV; Supplier 1: Digi-Key; Manufacturer Part Number: 43045-0200; Stock 1: 6320; Pricing 1: 1=0.97000, 10=0.84900, 100=0.73280, 500=0.59958, 1000=0.53296, 5000=0.46634, 10000=0.44302 (USD); RoHS: Yes; Mount: Through Hole; Case/Package: SMC; Contact Plating: Tin; Color: Black; Contact Material: Brass,Tin; Housing Color: Black; Housing Material: Thermoplastic; Material: Thermoplastic; Min Operating Temperature: -40°C; Max Operating Temperature: 105°C; Termination: Through Hole; Number of Rows: 2; Orientation: Right Angle; Packaging: Tray; Number of Positions: 2; Package Quantity: 3168; Number of Circuits: 2; Contact Gender: Male; Diameter: 3mm; Row Spacing: 3mm; Radiation Hardening: No; Flammability Rating: UL94 V-0; REACH SVHC: Unknown; Lead Free: Lead Free; Halogen Free: Low Halogen; ComponentLink1URL: https://datasheet.ciiva.com/14155/04402310-14155203.pdf?src-supplier=Distrelec; ComponentLink1Description: https://datasheet.ciiva.com/14155/04402310-14155203.pdf?src-supplier=Distrelec; ComponentLink2URL: https://datasheet.ciiva.com/19454/883270-19454006.pdf?src-supplier=Jameco; ComponentLink2Description: https://datasheet.ciiva.com/19454/883270-19454006.pdf?src-supplier=Jameco; ComponentLink3URL: https://datasheet.ciiva.com/5150/0430450200-pcb-headers-145770-5150407.pdf?src-supplier=Mouser; ComponentLink3Description: https://datasheet.ciiva.com/5150/0430450200-pcb-headers-145770-5150407.pdf?src-supplier=Mouser; ComponentLink4URL: https://datasheet.ciiva.com/11747/0900766b80027348-11747001.pdf?src-supplier=RSComponents; ComponentLink4Description: https://datasheet.ciiva.com/11747/0900766b80027348-11747001.pdf?src-supplier=RSComponents; ComponentLink5URL: https://datasheet.ciiva.com/16656/0430450200-pcb-headers-16656330.pdf?src-supplier=Avnet+Europe; ComponentLink5Description: https://datasheet.ciiva.com/16656/0430450200-pcb-headers-16656330.pdf?src-supplier=Avnet+Europe; ComponentLink6URL: https://datasheet.ciiva.com/10090/0430450200-pcb-headers-10090299.pdf?src-supplier=Avnet; ComponentLink6Description: https://datasheet.ciiva.com/10090/0430450200-pcb-headers-10090299.pdf?src-supplier=Avnet; ComponentLink7URL: https://datasheet.ciiva.com/36854/124280430450200-pcb-headers-36854331.pdf?src-supplier=Onlinecomponents.com; ComponentLink7Description: https://datasheet.ciiva.com/36854/124280430450200-pcb-headers-36854331.pdf?src-supplier=Onlinecomponents.com; ComponentLink8URL: https://datasheet.ciiva.com/1443/1859921-1443437.pdf?src-supplier=Element14; ComponentLink8Description: https://datasheet.ciiva.com/1443/1859921-1443437.pdf?src-supplier=Element14
Q1 Q2 = N-MOS: as Q3 on sheet battery_interface; Digikey Link: https://www.digikey.com/product-detail/en/on-semiconductor/NTD3055L104T4G/NTD3055L104T4GOSDKR-ND/1749196; Digikey P/N: NTD3055L104T4GOSDKR-ND
R27 = ERJ-P06J102V: RES SMD 1K OHM 5% 1/2W 0805; Manufacturer: Panasonic Electronic Components; Factory Stock: 0; Unit Price (USD): 0.01839; @ qty: 1500; Minimum Quantity: 1; Power (Watts): 0.5W, 1/2W; Temperature Coefficient: ±200ppm/°C; Part Number: ERJ-P06J102V; Datasheets: https://industrial.panasonic.com/cdbs/www-data/pdf/RDA0000/AOA0000C243.pdf; Image: //media.digikey.com/Renders/Panasonic%20Renders/ERJ-0805%20Pkg.jpg; Digi-Key Part Number: P1.0KADCT-ND; Quantity Available: 124757; Packaging: Cut Tape (CT); Series: ERJ; Part Status: Active; Value: 1k; Tolerance: ±5%; Composition: Thick Film; Features: Automotive AEC-Q200, Pulse Withstanding; Operating Temperature: -55°C ~ 155°C; Package / Case: 0805 (2012 Metric); Supplier Device Package: 0805; Size / Dimension: 0.079" L x 0.049" W (2.00mm x 1.25mm); Height - Seated (Max): 0.028" (0.70mm); Number of Terminations: 2; Failure Rate: -
R28 R32 = ERJ-6ENF5103V: RES SMD 510K OHM 1% 1/8W 0805; Manufacturer: Panasonic Electronic Components; Factory Stock: 0; Unit Price (USD): 0.00729; @ qty: 1500; Minimum Quantity: 1; Power (Watts): 0.125W, 1/8W; Temperature Coefficient: ±100ppm/°C; Part Number: ERJ-6ENF5103V; Datasheets: http://industrial.panasonic.com/www-cgi/jvcr13pz.cgi?E+PZ+3+AOA0002+ERJ6ENF5103V+7+WW; Image: //media.digikey.com/Renders/Panasonic%20Renders/ERJ-0805%20Pkg.jpg; Digi-Key Part Number: P510KCCT-ND; Quantity Available: 23343; Packaging: Cut Tape (CT); Series: ERJ; Part Status: Active; Value: 510k; Tolerance: ±1%; Composition: Thick Film; Features: Automotive AEC-Q200; Operating Temperature: -55°C ~ 155°C; Package / Case: 0805 (2012 Metric); Supplier Device Package: 0805; Size / Dimension: 0.079" L x 0.049" W (2.00mm x 1.25mm); Height - Seated (Max): 0.028" (0.70mm); Number of Terminations: 2; Failure Rate: -
R29 R34 = ERJ-6ENF2553V: RES SMD 255K OHM 1% 1/8W 0805; Manufacturer: Panasonic Electronic Components; Factory Stock: 0; Unit Price (USD): 0.00729; @ qty: 1500; Minimum Quantity: 1; Power (Watts): 0.125W, 1/8W; Temperature Coefficient: ±100ppm/°C; Part Number: ERJ-6ENF2553V; Datasheets: http://industrial.panasonic.com/www-cgi/jvcr13pz.cgi?E+PZ+3+AOA0002+ERJ6ENF2553V+7+WW; Image: //media.digikey.com/Renders/Panasonic%20Renders/ERJ-0805%20Pkg.jpg; Digi-Key Part Number: P255KCCT-ND; Quantity Available: 49587; Packaging: Cut Tape (CT); Series: ERJ; Part Status: Active; Value: 255k; Tolerance: ±1%; Composition: Thick Film; Features: Automotive AEC-Q200; Operating Temperature: -55°C ~ 155°C; Package / Case: 0805 (2012 Metric); Supplier Device Package: 0805; Size / Dimension: 0.079" L x 0.049" W (2.00mm x 1.25mm); Height - Seated (Max): 0.028" (0.70mm); Number of Terminations: 2; Failure Rate: -
R30 = ERJ-6ENF5101V: RES SMD 5.1K OHM 1% 1/8W 0805; Manufacturer: Panasonic Electronic Components; Factory Stock: 0; Unit Price (USD): 0.00729; @ qty: 1500; Minimum Quantity: 1; Power (Watts): 0.125W, 1/8W; Temperature Coefficient: ±100ppm/°C; Part Number: ERJ-6ENF5101V; Datasheets: http://industrial.panasonic.com/www-cgi/jvcr13pz.cgi?E+PZ+3+AOA0002+ERJ6ENF5101V+7+WW; Image: //media.digikey.com/Renders/Panasonic%20Renders/ERJ-0805%20Pkg.jpg; Digi-Key Part Number: P5.10KCCT-ND; Quantity Available: 74332; Packaging: Cut Tape (CT); Series: ERJ; Part Status: Active; Value: 5.1k; Tolerance: ±1%; Composition: Thick Film; Features: Automotive AEC-Q200; Operating Temperature: -55°C ~ 155°C; Package / Case: 0805 (2012 Metric); Supplier Device Package: 0805; Size / Dimension: 0.079" L x 0.049" W (2.00mm x 1.25mm); Height - Seated (Max): 0.028" (0.70mm); Number of Terminations: 2; Failure Rate: -
R31 = ERJ-6ENF34R0V: RES SMD 34 OHM 1% 1/8W 0805; Manufacturer: Panasonic Electronic Components; Factory Stock: 0; Unit Price (USD): 0.00729; @ qty: 1500; Minimum Quantity: 1; Power (Watts): 0.125W, 1/8W; Temperature Coefficient: ±100ppm/°C; Part Number: ERJ-6ENF34R0V; Datasheets: http://industrial.panasonic.com/www-cgi/jvcr13pz.cgi?E+PZ+3+AOA0002+ERJ6ENF34R0V+7+WW; Image: //media.digikey.com/Renders/Panasonic%20Renders/ERJ-0805%20Pkg.jpg; Digi-Key Part Number: P34.0CCT-ND; Quantity Available: 49762; Packaging: Cut Tape (CT); Series: ERJ; Part Status: Active; Value: 34; Tolerance: ±1%; Composition: Thick Film; Features: Automotive AEC-Q200; Operating Temperature: -55°C ~ 155°C; Package / Case: 0805 (2012 Metric); Supplier Device Package: 0805; Size / Dimension: 0.079" L x 0.049" W (2.00mm x 1.25mm); Height - Seated (Max): 0.028" (0.70mm); Number of Terminations: 2; Failure Rate: -
R33 = ERJ-6ENF68R0V: RES SMD 68 OHM 1% 1/8W 0805; Manufacturer: Panasonic Electronic Components; Factory Stock: 0; Unit Price (USD): 0.00729; @ qty: 1500; Minimum Quantity: 1; Power (Watts): 0.125W, 1/8W; Temperature Coefficient: ±100ppm/°C; Part Number: ERJ-6ENF68R0V; Datasheets: http://industrial.panasonic.com/www-cgi/jvcr13pz.cgi?E+PZ+3+AOA0002+ERJ6ENF68R0V+7+WW; Image: //media.digikey.com/Renders/Panasonic%20Renders/ERJ-0805%20Pkg.jpg; Digi-Key Part Number: P68.0CCT-ND; Quantity Available: 47206; Packaging: Cut Tape (CT); Series: ERJ; Part Status: Active; Value: 68; Tolerance: ±1%; Composition: Thick Film; Features: Automotive AEC-Q200; Operating Temperature: -55°C ~ 155°C; Package / Case: 0805 (2012 Metric); Supplier Device Package: 0805; Size / Dimension: 0.079" L x 0.049" W (2.00mm x 1.25mm); Height - Seated (Max): 0.028" (0.70mm); Number of Terminations: 2; Failure Rate: -
TP3 TP4 = TP: SMD TEST POINT
U6 = TPS3701DDCT: IC COMP WINDOW W/REF 6SOT; Manufacturer: Texas Instruments; Min Supply Voltage: 1.8V; Max Supply Voltage: 36V; Number of Elements: 1; Quiescent Current: 11uA; Propagation Delay: 28.1us; Hysteresis: 5.5mV; Response Time: 155us; Supplier 1: Digi-Key; Stock 1: 2174; Pricing 1: 1=2.74, 10=2.459, 25=2.32, 100=1.8561 (USD); Mount: Surface Mount; Case/Package: SOT-23-6; Number of Pins: 6; Min Operating Temperature: -40°C; Max Operating Temperature: 125°C; Packaging: Tape and Reel; REACH SVHC: No SVHC; Lead Free: Lead Free; ComponentLink1URL: http://www.ti.com/general/docs/lit/getliterature.tsp?genericPartNumber=TPS3701&amp;&amp;fileType=pdf&src-supplier=Farnell; ComponentLink1Description: http://www.ti.com/general/docs/lit/getliterature.tsp?genericPartNumber=TPS3701&amp;&amp;fileType=pdf&src-supplier=Farnell; ComponentLink2URL: http://www.ti.com/general/docs/lit/getliterature.tsp?genericPartNumber=TPS3701&&fileType=pdf&src-supplier=Element14; ComponentLink2Description: http://www.ti.com/general/docs/lit/getliterature.tsp?genericPartNumber=TPS3701&&fileType=pdf&src-supplier=Element14; ComponentLink3URL: http://www.ti.com/lit/ds/symlink/tps3701.pdf?src-supplier=Digi-Key; ComponentLink3Description: http://www.ti.com/lit/ds/symlink/tps3701.pdf?src-supplier=Digi-Key; ComponentLink4URL: http://www.ti.com/general/docs/lit/getliterature.tsp?genericPartNumber=TPS3701&&fileType=pdf&src-supplier=Avnet; ComponentLink4Description: http://www.ti.com/general/docs/lit/getliterature.tsp?genericPartNumber=TPS3701&&fileType=pdf&src-supplier=Avnet; ComponentLink5URL: http://www.ti.com/lit/gpn/tps3701?src-supplier=Mouser; ComponentLink5Description: http://www.ti.com/lit/gpn/tps3701?src-supplier=Mouser; Supplier Part Number 1: 296-38622-1-ND

## Sheet gpio.SchDoc: GPIO
size A4; Organization: Badgerloop; Address1: 133 Engineering Research; Address2: Building; Address3: Madison, WI 53715; SheetNumber: 18
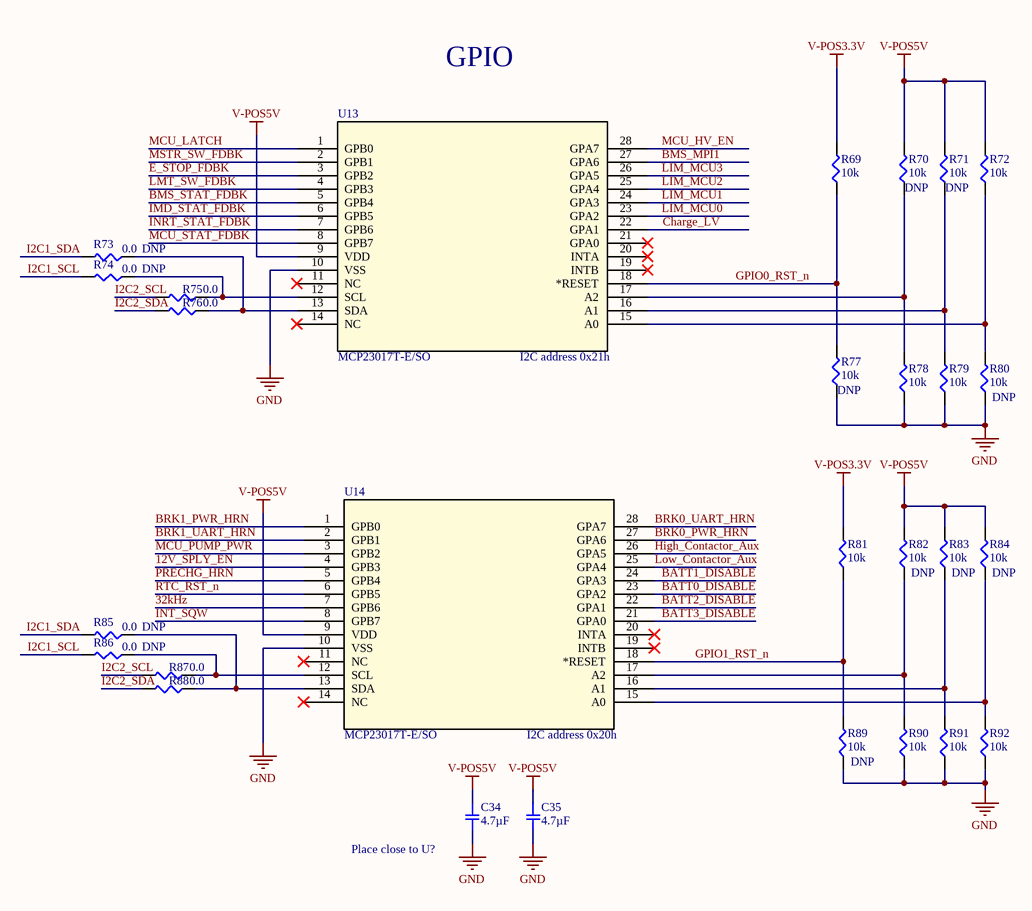
[diagram p17: gpio.SchDoc]

### Parts
C34  4.7µF  [SMD-0805C]
C35  4.7µF  [SMD-0805C]
R69  10k  [SMD-0805-RES]
R70  10k  [SMD-0805-RES]
R71  10k  [SMD-0805-RES]
R72  10k  [SMD-0805-RES]
R73  0.0  [SMD-0805-RES]
R74  0.0  [SMD-0805-RES]
R75  0.0  [SMD-0805-RES]
R76  0.0  [SMD-0805-RES]
R77  10k  [SMD-0805-RES]
R78  10k  [SMD-0805-RES]
R79  10k  [SMD-0805-RES]
R80  10k  [SMD-0805-RES]
R81  10k  [SMD-0805-RES]
R82  10k  [SMD-0805-RES]
R83  10k  [SMD-0805-RES]
R84  10k  [SMD-0805-RES]
R85  0.0  [SMD-0805-RES]
R86  0.0  [SMD-0805-RES]
R87  0.0  [SMD-0805-RES]
R88  0.0  [SMD-0805-RES]
R89  10k  [SMD-0805-RES]
R90  10k  [SMD-0805-RES]
R91  10k  [SMD-0805-RES]
R92  10k  [SMD-0805-RES]
U13  MCP23017T-E/SO  [SOIC28-W_MC-M]
U14  MCP23017T-E/SO  [SOIC28-W_MC-M]

### Nets
GND: C34.2 C35.2 R77.1 R78.1 R79.1 R80.1 R89.1 R90.1 R91.1 R92.1 U13.10(VSS) U14.10(VSS)
V-POS3.3V: R69.2 R81.2
V-POS5V: C34.1 C35.1 R70.2 R71.2 R72.2 R82.2 R83.2 R84.2 U13.9(VDD) U14.9(VDD)
12V_SPLY_EN: U14.4(GPB3)
32kHz: U14.7(GPB6)
BATT0_DISABLE: U14.23(GPA2)
BATT1_DISABLE: U14.24(GPA3)
BATT2_DISABLE: U14.22(GPA1)
BATT3_DISABLE: U14.21(GPA0)
BMS_MPI1: U13.27(GPA6)
BMS_STAT_FDBK: U13.5(GPB4)
BRK0_PWR_HRN: U14.27(GPA6)
BRK0_UART_HRN: U14.28(GPA7)
BRK1_PWR_HRN: U14.1(GPB0)
BRK1_UART_HRN: U14.2(GPB1)
Charge_LV: U13.22(GPA1)
E_STOP_FDBK: U13.3(GPB2)
GPIO0_RST_n: R69.1 R77.2 U13.18(*RESET)
GPIO1_RST_n: R81.1 R89.2 U14.18(*RESET)
High_Contactor_Aux: U14.26(GPA5)
I2C1_SCL: R74.2 R86.2
I2C1_SDA: R73.2 R85.2
I2C2_SCL: R75.2 R87.2
I2C2_SDA: R76.2 R88.2
IMD_STAT_FDBK: U13.6(GPB5)
INRT_STAT_FDBK: U13.7(GPB6)
INT_SQW: U14.8(GPB7)
LIM_MCU0: U13.23(GPA2)
LIM_MCU1: U13.24(GPA3)
LIM_MCU2: U13.25(GPA4)
LIM_MCU3: U13.26(GPA5)
LMT_SW_FDBK: U13.4(GPB3)
Low_Contactor_Aux: U14.25(GPA4)
MCU_HV_EN: U13.28(GPA7)
MCU_Latch: U13.1(GPB0)
MCU_PUMP_PWR: U14.3(GPB2)
MCU_STAT_FDBK: U13.8(GPB7)
MSTR_SW_FDBK: U13.2(GPB1)
PRECHG_HRN: U14.5(GPB4)
RTC_RST_n: U14.6(GPB5)
NetR70_1: R70.1 R78.2 U13.17(A2)
NetR71_1: R71.1 R79.2 U13.16(A1)
NetR72_1: R72.1 R80.2 U13.15(A0)
NetR73_1: R73.1 R76.1 U13.13(SDA)
NetR74_1: R74.1 R75.1 U13.12(SCL)
NetR82_1: R82.1 R90.2 U14.17(A2)
NetR83_1: R83.1 R91.2 U14.16(A1)
NetR84_1: R84.1 R92.2 U14.15(A0)
NetR85_1: R85.1 R88.1 U14.13(SDA)
NetR86_1: R86.1 R87.1 U14.12(SCL)

Not connected (* = marked no-connect by the designer): U13 11(NC)* 14(NC)* 19(INTB)* 20(INTA)* 21(GPA0)*; U14 11(NC)* 14(NC)* 19(INTB)* 20(INTA)*

### Notes on the sheet
- GPIO
- (near U13) I2C address 0x21h
- (near U14) I2C address 0x20h
- (near C34) Place close to U?
- Title
- Size:
- Date:
- A4
- Number:
- Time:
- Revision:
- Sheet
- of
- File:

### Library data of the parts
C34 C35 = GRM21BR60J475KA11L: CAP CER 4.7UF 6.3V X5R 0805; Manufacturer: Murata Electronics North America; Factory Stock: 0; Unit Price (USD): 0.28; Minimum Quantity: 1; Tolerance: ±10%; Datasheets: http://www.murata.com/~/media/webrenewal/support/library/catalog/products/capacitor/mlcc/c02e.pdf; Image: //media.digikey.com/Renders/Murata%20Renders/0805%20(2012%20Metric)%20.85mm.jpg; Digi-Key Part Number: 490-9749-1-ND; Part Number: GRM21BR60J475KA11L; Quantity Available: 2821; @ qty: 0; Packaging: Cut Tape (CT); Series: GRM; Part Status: Active; Value: 4.7µF; Voltage: 6.3V; Temperature Coefficient: X5R; Operating Temperature: -55°C ~ 85°C; Features: -; Ratings: -; Applications: General Purpose; Mounting Type: Surface Mount, MLCC; Package / Case: 0805 (2012 Metric); Size / Dimension: 0.079" L x 0.049" W (2.00mm x 1.25mm); Height - Seated (Max): -; Thickness (Max): 0.055" (1.40mm); Lead Spacing: -; Lead Style: -
R69-R72 R77-R84 R89-R92 = ERJ-P06J103V: as R1-R5 on sheet adc; Part Number: ERJ-P06J103V; Datasheets: https://industrial.panasonic.com/cdbs/www-data/pdf/RDA0000/AOA0000C243.pdf; Image: //media.digikey.com/Renders/Panasonic%20Renders/ERJ-0805%20Pkg.jpg; Digi-Key Part Number: P10KADCT-ND; Quantity Available: 413576; Packaging: Cut Tape (CT); Series: ERJ; Part Status: Active; Value: 10k; Tolerance: ±5%; Composition: Thick Film; Features: Automotive AEC-Q200, Pulse Withstanding; Operating Temperature: -55°C ~ 155°C; Package / Case: 0805 (2012 Metric); Supplier Device Package: 0805; Size / Dimension: 0.079" L x 0.049" W (2.00mm x 1.25mm); Height - Seated (Max): 0.028" (0.70mm); Number of Terminations: 2; Failure Rate: -
  R70 R71 R77 R80 R82-R84 R89: DNP: DNP
R73-R76 R85-R88 = ERJ-6GEY0R00V: as R6-R9 on sheet adc; Part Number: ERJ-6GEY0R00V; Datasheets: http://industrial.panasonic.com/www-cgi/jvcr13pz.cgi?E+PZ+3+AOA0001+ERJ6GEY0R00V+7+WW; Image: //media.digikey.com/Renders/Panasonic%20Renders/ERJ-0805%20Pkg.jpg; Digi-Key Part Number: P0.0ACT-ND; Quantity Available: 1597627; Packaging: Cut Tape (CT); Series: ERJ; Part Status: Active; Value: 0.0; Tolerance: Jumper; Composition: Thick Film; Features: Automotive AEC-Q200; Temperature Coefficient: -; Operating Temperature: -55°C ~ 155°C; Package / Case: 0805 (2012 Metric); Supplier Device Package: 0805; Size / Dimension: 0.079" L x 0.049" W (2.00mm x 1.25mm); Height - Seated (Max): 0.028" (0.70mm); Number of Terminations: 2; Failure Rate: -
  R73 R74 R85 R86: DNP: DNP
U13 U14 = MCP23017T-E/SO: IC I/O EXPANDER I2C 16B 28SOIC; Manufacturer: Microchip; Manufacturer P/N: MCP23017T-E/SO; Digikey P/N: MCP23017T-E/SOCT-ND; Digikey Link: https://www.digikey.com/product-detail/en/microchip-technology/MCP23017T-E-SO/MCP23017T-E-SOCT-ND/5358289